# EAGLE schematic Output (EAGLE 9.6.2)
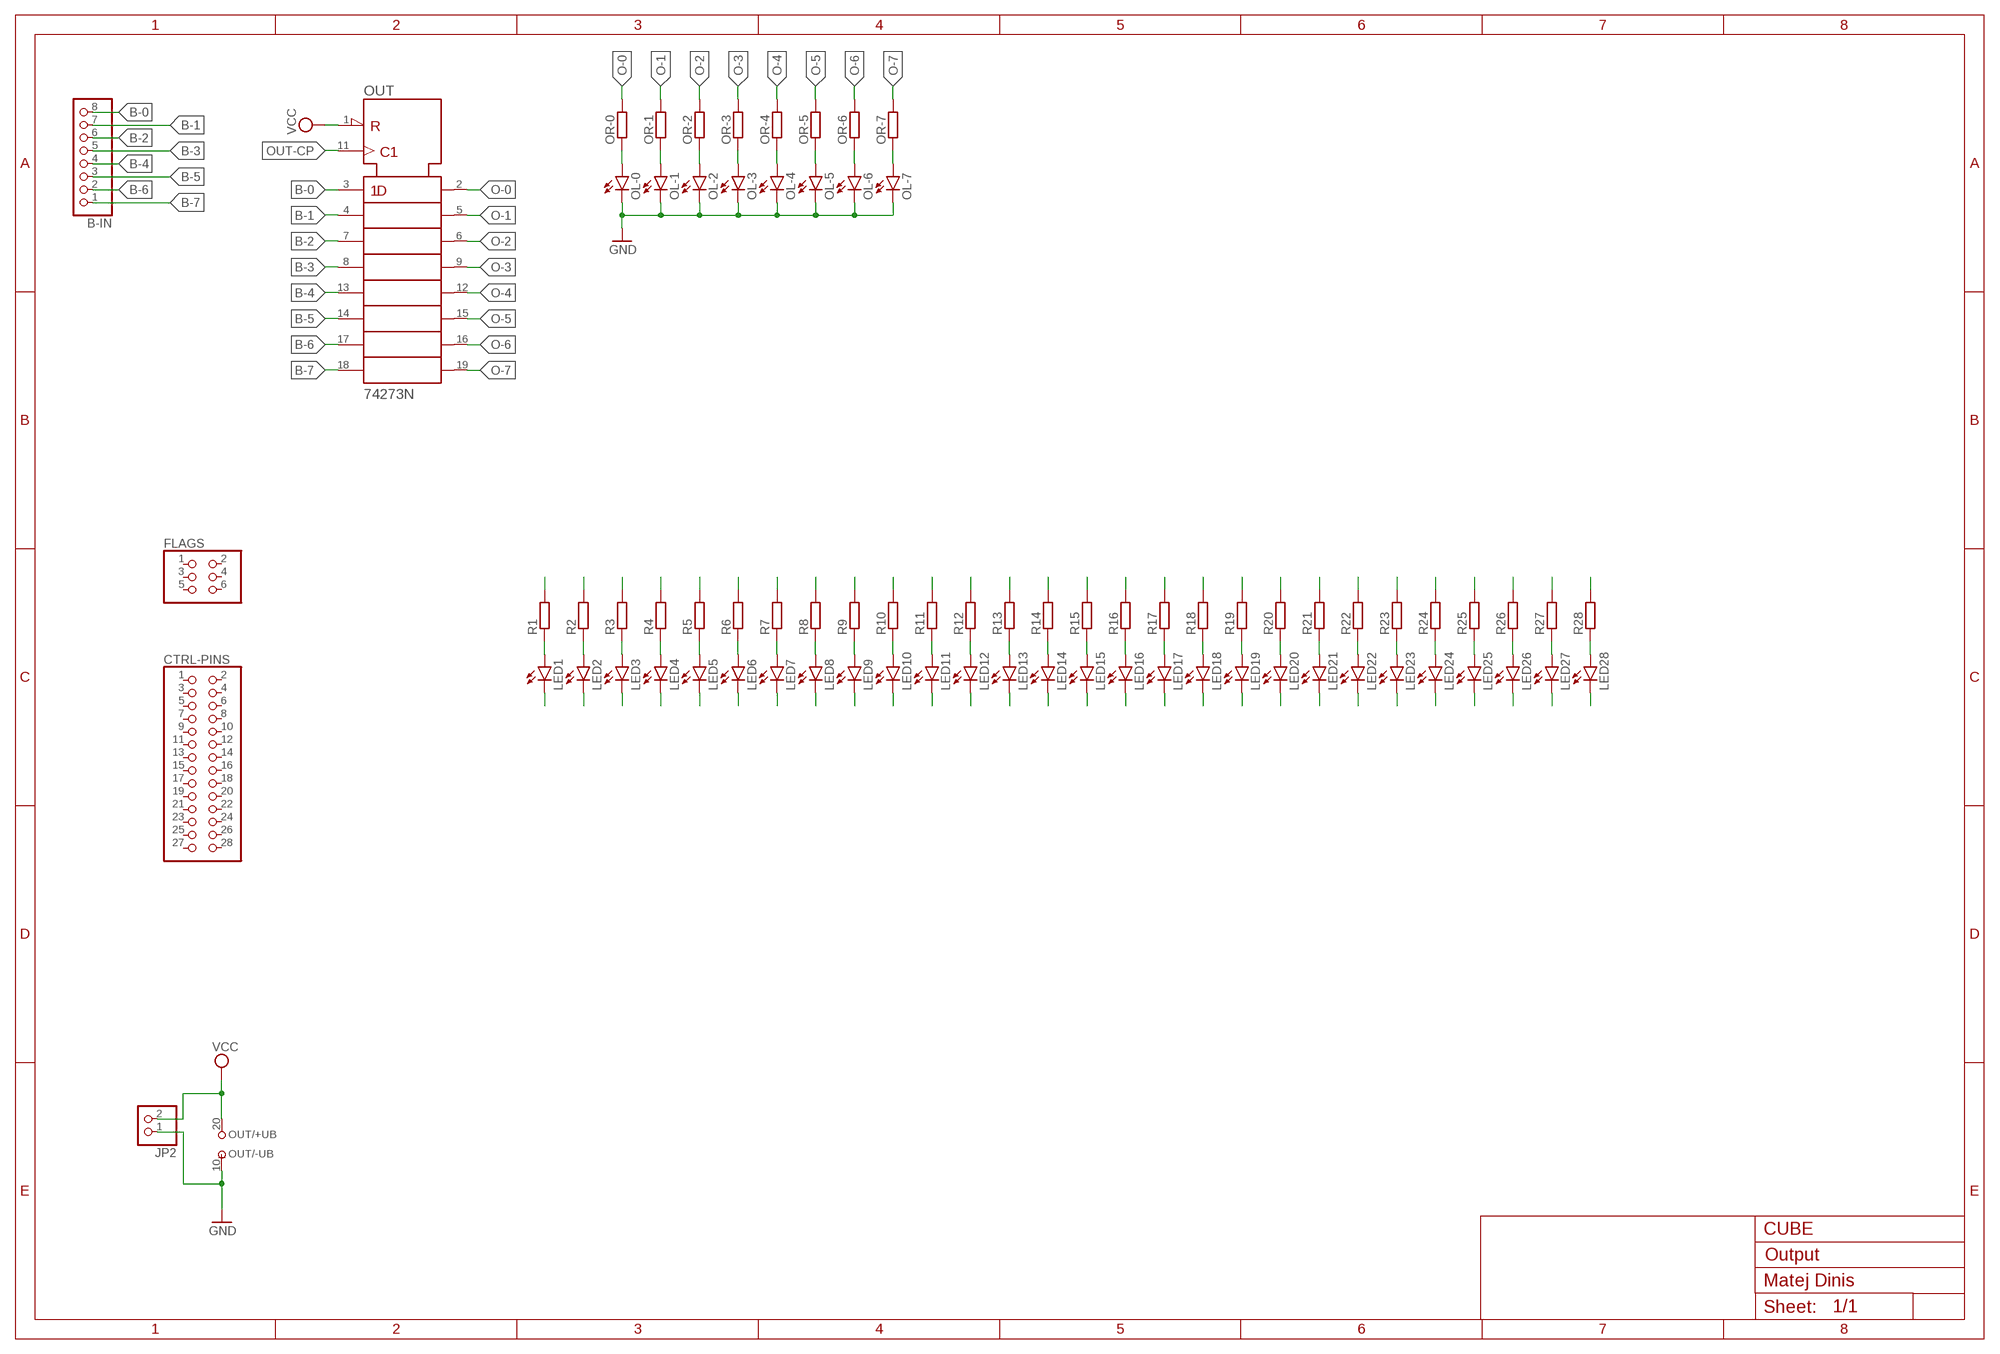
[diagram p0: schematic, sheet 1]

## Parts
B-IN  PINHD-1X8  [1X08]
CTRL-PINS  PINHD-2X14  [2X14]
FLAGS  PINHD-2X3  [2X03]
JP2  PINHD-1X2  [1X02]
LED1  LED5MM  [LED5MM]
LED2  LED5MM  [LED5MM]
LED3  LED5MM  [LED5MM]
LED4  LED5MM  [LED5MM]
LED5  LED5MM  [LED5MM]
LED6  LED5MM  [LED5MM]
LED7  LED5MM  [LED5MM]
LED8  LED5MM  [LED5MM]
LED9  LED5MM  [LED5MM]
LED10  LED5MM  [LED5MM]
LED11  LED5MM  [LED5MM]
LED12  LED5MM  [LED5MM]
LED13  LED5MM  [LED5MM]
LED14  LED5MM  [LED5MM]
LED15  LED5MM  [LED5MM]
LED16  LED5MM  [LED5MM]
LED17  LED5MM  [LED5MM]
LED18  LED5MM  [LED5MM]
LED19  LED5MM  [LED5MM]
LED20  LED5MM  [LED5MM]
LED21  LED5MM  [LED5MM]
LED22  LED5MM  [LED5MM]
LED23  LED5MM  [LED5MM]
LED24  LED5MM  [LED5MM]
LED25  LED5MM  [LED5MM]
LED26  LED5MM  [LED5MM]
LED27  LED5MM  [LED5MM]
LED28  LED5MM  [LED5MM]
OL-0  LED5MM  [LED5MM]
OL-1  LED5MM  [LED5MM]
OL-2  LED5MM  [LED5MM]
OL-3  LED5MM  [LED5MM]
OL-4  LED5MM  [LED5MM]
OL-5  LED5MM  [LED5MM]
OL-6  LED5MM  [LED5MM]
OL-7  LED5MM  [LED5MM]
OR-0  R-EU_0207/10  [0207/10]
OR-1  R-EU_0207/10  [0207/10]
OR-2  R-EU_0207/10  [0207/10]
OR-3  R-EU_0207/10  [0207/10]
OR-4  R-EU_0207/10  [0207/10]
OR-5  R-EU_0207/10  [0207/10]
OR-6  R-EU_0207/10  [0207/10]
OR-7  R-EU_0207/10  [0207/10]
OUT  74273N  [DIL20]
R1  R-EU_0207/10  [0207/10]
R2  R-EU_0207/10  [0207/10]
R3  R-EU_0207/10  [0207/10]
R4  R-EU_0207/10  [0207/10]
R5  R-EU_0207/10  [0207/10]
R6  R-EU_0207/10  [0207/10]
R7  R-EU_0207/10  [0207/10]
R8  R-EU_0207/10  [0207/10]
R9  R-EU_0207/10  [0207/10]
R10  R-EU_0207/10  [0207/10]
R11  R-EU_0207/10  [0207/10]
R12  R-EU_0207/10  [0207/10]
R13  R-EU_0207/10  [0207/10]
R14  R-EU_0207/10  [0207/10]
R15  R-EU_0207/10  [0207/10]
R16  R-EU_0207/10  [0207/10]
R17  R-EU_0207/10  [0207/10]
R18  R-EU_0207/10  [0207/10]
R19  R-EU_0207/10  [0207/10]
R20  R-EU_0207/10  [0207/10]
R21  R-EU_0207/10  [0207/10]
R22  R-EU_0207/10  [0207/10]
R23  R-EU_0207/10  [0207/10]
R24  R-EU_0207/10  [0207/10]
R25  R-EU_0207/10  [0207/10]
R26  R-EU_0207/10  [0207/10]
R27  R-EU_0207/10  [0207/10]
R28  R-EU_0207/10  [0207/10]

## Nets
B-0: B-IN.8 OUT.3(1D)
B-1: B-IN.7 OUT.4(2D)
B-2: B-IN.6 OUT.7(3D)
B-3: B-IN.5 OUT.8(4D)
B-4: B-IN.4 OUT.13(5D)
B-5: B-IN.3 OUT.14(6D)
B-6: B-IN.2 OUT.17(7D)
B-7: B-IN.1 OUT.18(8D)
GND: JP2.1 OL-0.K(C) OL-1.K(C) OL-2.K(C) OL-3.K(C) OL-4.K(C) OL-5.K(C) OL-6.K(C) OL-7.K(C) OUT.10(-UB)
N$1: LED1.A R1.1
N$2: OL-0.A OR-0.1
N$3: LED1.K(C)
N$4: R1.2
N$5: OL-1.A OR-1.1
N$6: LED2.A R2.1
N$7: LED2.K(C)
N$8: OL-2.A OR-2.1
N$9: R2.2
N$10: LED3.A R3.1
N$11: OL-3.A OR-3.1
N$12: LED3.K(C)
N$13: R3.2
N$14: OL-4.A OR-4.1
N$15: LED4.A R4.1
N$16: LED4.K(C)
N$17: OL-5.A OR-5.1
N$18: R4.2
N$19: LED5.A R5.1
N$20: OL-6.A OR-6.1
N$21: LED5.K(C)
N$22: R5.2
N$23: OL-7.A OR-7.1
N$24: LED6.A R6.1
N$25: LED6.K(C)
N$26: R6.2
N$27: LED7.A R7.1
N$28: LED7.K(C)
N$29: R7.2
N$30: LED8.A R8.1
N$31: LED8.K(C)
N$32: R8.2
N$33: LED9.A R9.1
N$34: LED9.K(C)
N$35: R9.2
N$36: LED10.A R10.1
N$37: LED10.K(C)
N$38: R10.2
N$39: LED11.A R11.1
N$40: LED11.K(C)
N$41: R11.2
N$42: LED12.A R12.1
N$43: LED12.K(C)
N$44: R12.2
N$45: LED13.A R13.1
N$46: LED13.K(C)
N$47: R13.2
N$48: LED14.A R14.1
N$49: LED14.K(C)
N$50: R14.2
N$51: LED15.A R15.1
N$52: LED15.K(C)
N$53: R15.2
N$54: LED16.A R16.1
N$55: LED16.K(C)
N$56: R16.2
N$57: LED17.A R17.1
N$58: LED17.K(C)
N$59: R17.2
N$60: LED18.A R18.1
N$61: LED18.K(C)
N$62: R18.2
N$63: LED19.A R19.1
N$64: LED19.K(C)
N$65: R19.2
N$66: LED20.A R20.1
N$67: LED20.K(C)
N$68: R20.2
N$69: LED21.A R21.1
N$70: LED21.K(C)
N$71: R21.2
N$72: LED22.A R22.1
N$73: LED22.K(C)
N$74: R22.2
N$75: LED23.A R23.1
N$76: LED23.K(C)
N$77: R23.2
N$78: LED24.A R24.1
N$79: LED24.K(C)
N$80: R24.2
N$81: LED25.A R25.1
N$82: LED25.K(C)
N$83: R25.2
N$84: LED26.A R26.1
N$85: LED26.K(C)
N$86: R26.2
N$87: LED27.A R27.1
N$88: LED27.K(C)
N$89: R27.2
N$90: LED28.A R28.1
N$91: LED28.K(C)
N$92: R28.2
O-0: OR-0.2 OUT.2(1Q)
O-1: OR-1.2 OUT.5(2Q)
O-2: OR-2.2 OUT.6(3Q)
O-3: OR-3.2 OUT.9(4Q)
O-4: OR-4.2 OUT.12(5Q)
O-5: OR-5.2 OUT.15(6Q)
O-6: OR-6.2 OUT.16(7Q)
O-7: OR-7.2 OUT.19(8Q)
OUT-CP: OUT.11(CLK)
VCC: JP2.2 OUT.1(!CLR) OUT.20(+UB)
Unconnected: CTRL-PINS.1 CTRL-PINS.2 CTRL-PINS.3 CTRL-PINS.4 CTRL-PINS.5 CTRL-PINS.6 CTRL-PINS.7 CTRL-PINS.8 CTRL-PINS.9 CTRL-PINS.10 CTRL-PINS.11 CTRL-PINS.12 CTRL-PINS.13 CTRL-PINS.14 CTRL-PINS.15 CTRL-PINS.16 CTRL-PINS.17 CTRL-PINS.18 CTRL-PINS.19 CTRL-PINS.20 CTRL-PINS.21 CTRL-PINS.22 CTRL-PINS.23 CTRL-PINS.24 CTRL-PINS.25 CTRL-PINS.26 CTRL-PINS.27 CTRL-PINS.28 FLAGS.1 FLAGS.2 FLAGS.3 FLAGS.4 FLAGS.5 FLAGS.6

## Notes on the sheet
- CUBE
- Matej Dinis

## Library data of the parts
B-IN = pinhead:PINHD-1X8: PIN HEADER
CTRL-PINS = pinhead:PINHD-2X14: PIN HEADER
FLAGS = pinhead:PINHD-2X3: PIN HEADER
JP2 = pinhead:PINHD-1X2: PIN HEADER
LED1-LED28 OL-0 OL-1-OL-7 = led:LED: LED OSRAM: - CHIPLED LG R971, LG N971, LY N971, LG Q971, LY Q971, LO R971, LY R971 LH N974, LH R974 LS Q976, LO Q976, LY Q976 LO Q996 - Hyper CHIPLED LW Q18S LB Q993, LB Q99A, LB R99A - SideLED LS A670, LO A670, LY A670, LG A670, LP A670 LB A673, LV A673, LT A673, LW A673 LH A674 LY A675 LS A676, LA A676, LO A676, LY A676, LW A676 LS A679, LY A679, LG A679 - Hyper Micro SIDELED® LS Y876, LA Y876, LO Y876, LY Y876 LT Y87S - SmartLED LW L88C, LW L88S LB L89C, LB L89S, LG L890 LS L89K, LO L89K, LY L89K LS L896, LA L896, LO L896, LY L896 - TOPLED LS T670, LO T670, LY T670, LG T670, LP T670 LSG T670, LSP T670, LSY T670, LOP T670, LYG T670 LG T671, LOG T671, LSG T671 LB T673, LV T673, LT T673, LW T673 LH T674 LS T676, LA T676, LO T676, LY T676, LB T676, LH T676, LSB T676, LW T676 LB T67C, LV T67C, LT T67C, LS T67K, LO T67K, LY T67K, LW E67C LS E67B, LA E67B, LO E67B, LY E67B, LB E67C, LV E67C, LT E67C LW T67C LS T679, LY T679, LG T679 LS T770, LO T770, LY T770, LG T770, LP T770 LB T773, LV T773, LT T773, LW T773 LH T774 LS E675, LA E675, LY E675, LS T675 LS T776, LA T776, LO T776, LY T776, LB T776 LHGB T686 LT T68C, LB T68C - Hyper Mini TOPLED® LB M676 - Mini TOPLED Santana® LG M470 LS M47K, LO M47K, LY M47K Source: http://www.osram.convergy.de LUXEON: - LUMILED® LXK2-PW12-R00, LXK2-PW12-S00, LXK2-PW14-U00, LXK2-PW14-V00 LXK2-PM12-R00, LXK2-PM12-S00, LXK2-PM14-U00 LXK2-PE12-Q00, LXK2-PE12-R00, LXK2-PE12-S00, LXK2-PE14-T00, LXK2-PE14-U00 LXK2-PB12-K00, LXK2-PB12-L00, LXK2-PB12-M00, LXK2-PB14-N00, LXK2-PB14-P00, LXK2-PB14-Q00 LXK2-PR12-L00, LXK2-PR12-M00, LXK2-PR14-Q00, LXK2-PR14-R00 LXK2-PD12-Q00, LXK2-PD12-R00, LXK2-PD12-S00 LXK2-PH12-R00, LXK2-PH12-S00 LXK2-PL12-P00, LXK2-PL12-Q00, LXK2-PL12-R00 Source: www.luxeon.com KINGBRIGHT: KA-3528ASYC Source: www.kingbright.com
OR-0 OR-1-OR-7 R1-R28 = rcl:R-EU_: RESISTOR, European symbol; SPICEPREFIX: R
OUT = 74ttl-din:74*273: Octal D type FLIP FLOP, clear